# Altium schematic sheet TWindow.schDoc: LiveDesign Evaluation - Video Windows
size A3; Organization: Altium Limited; Address1: L3, 12a Rodborough Rd; Address2: Frenchs Forest; Address3: NSW; Address4: Australia 2086; DocumentNumber: 17; SheetNumber: 17; SheetTotal: 20
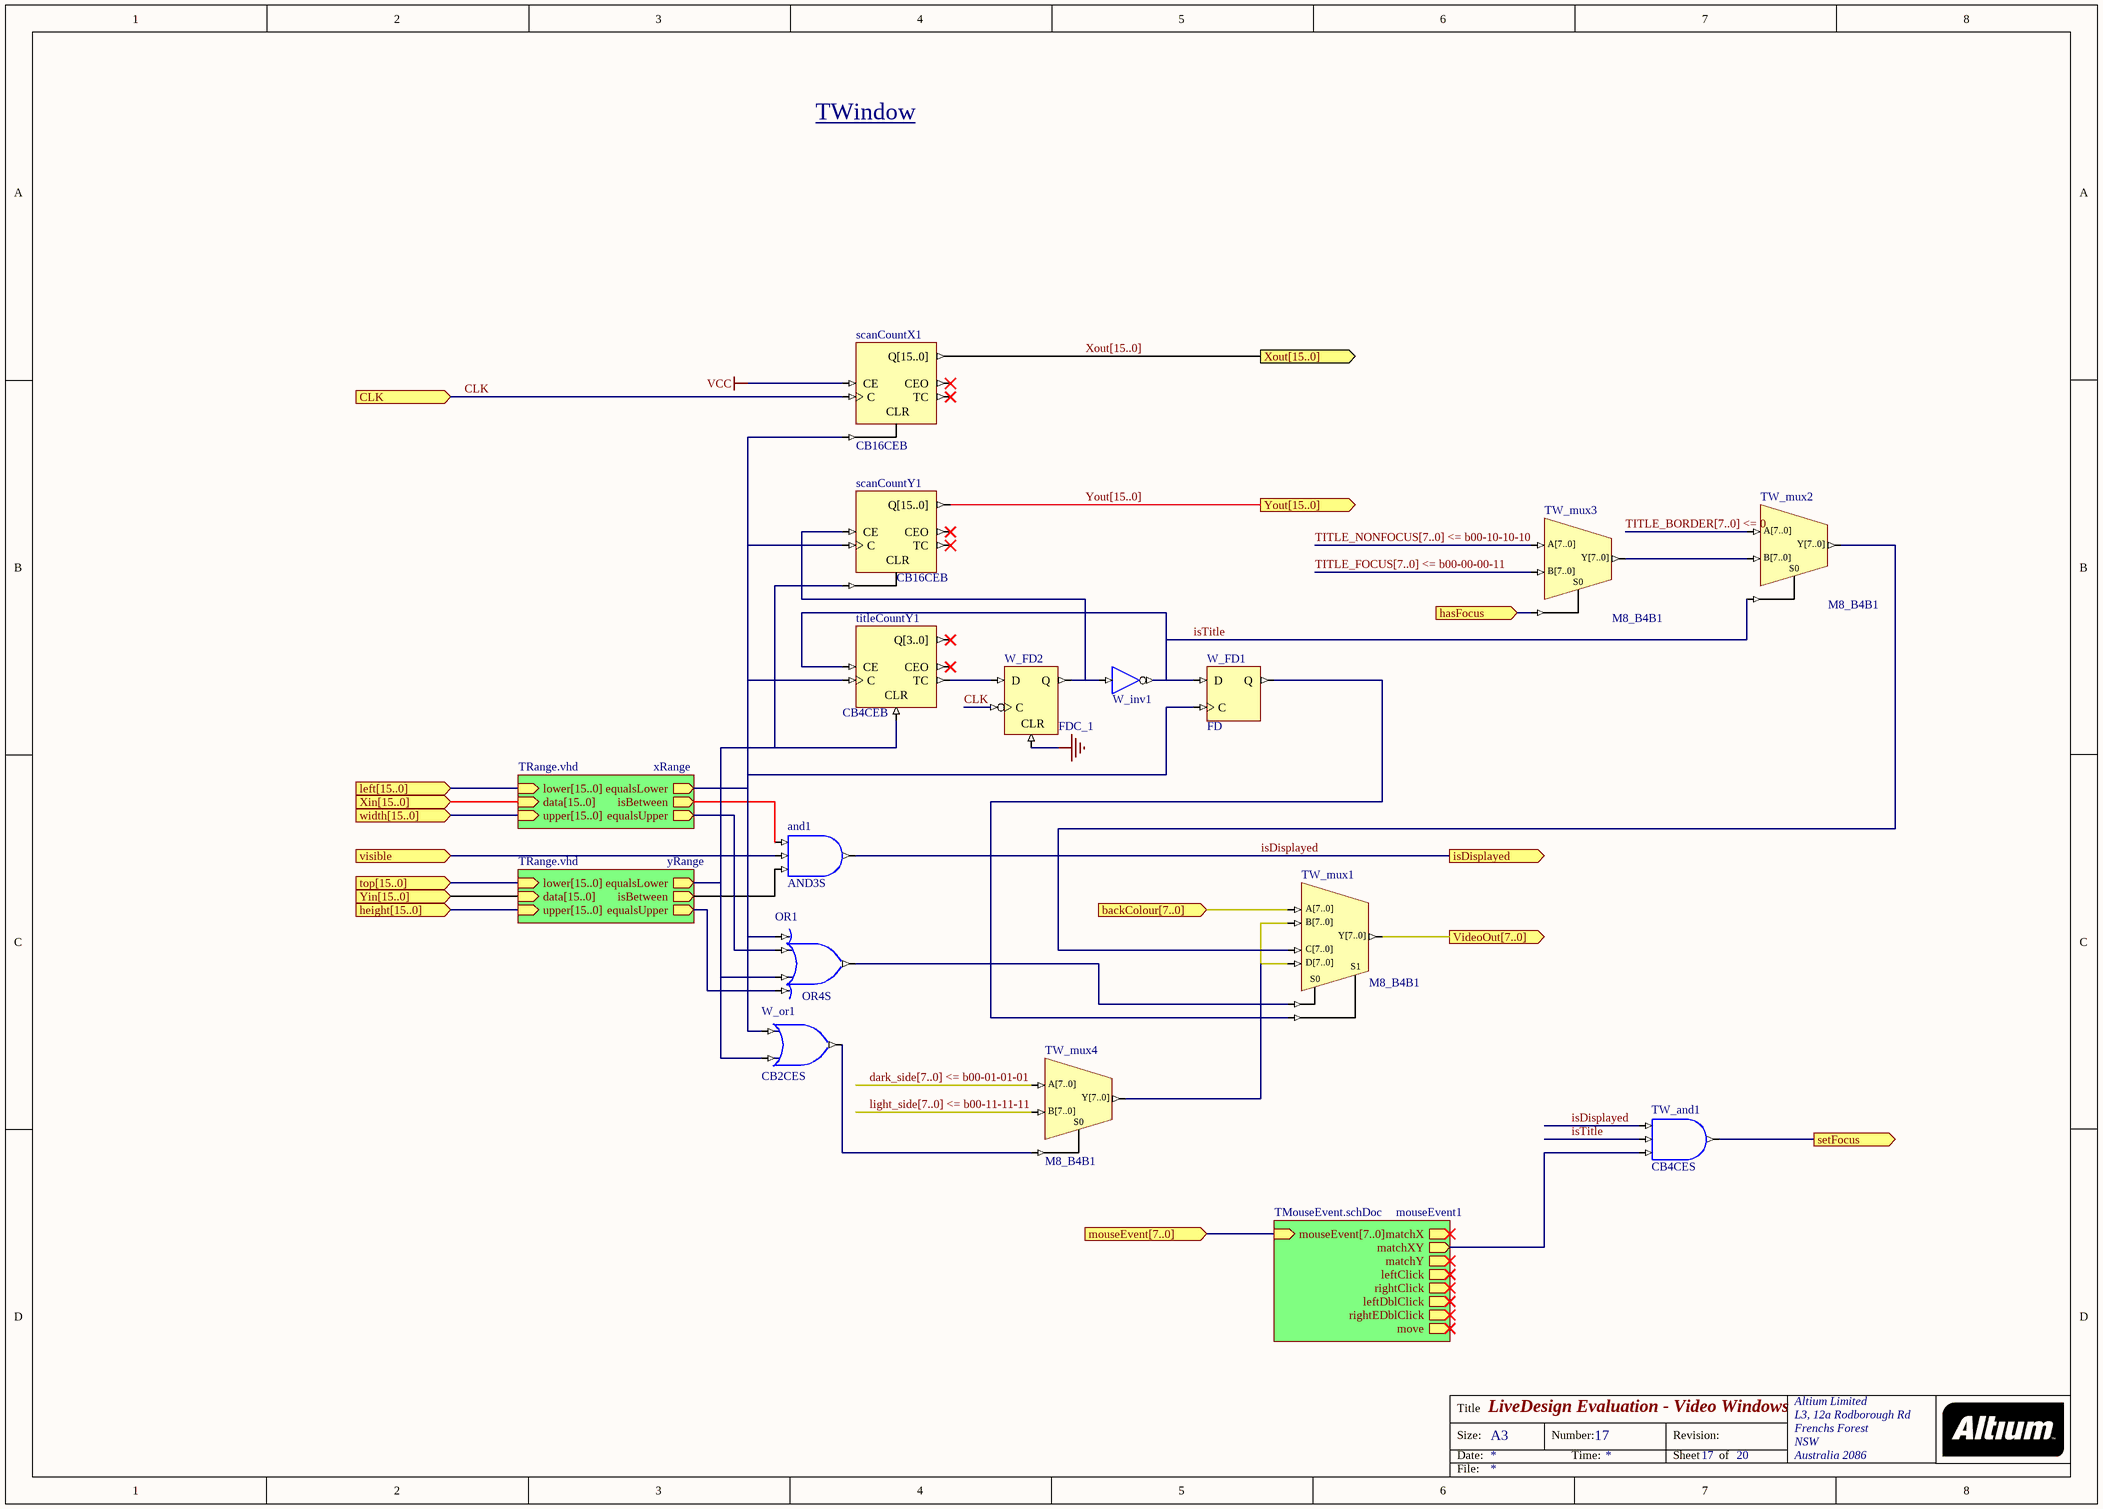
[diagram p0: TWindow.schDoc]

## Parts
and1  AND3S
OR1  OR4S
scanCountX1  CB16CEB
scanCountY1  CB16CEB
titleCountY1  CB4CEB
TW_and1  CB4CES
TW_mux1  M8_B4B1
TW_mux2  M8_B4B1
TW_mux3  M8_B4B1
TW_mux4  M8_B4B1
W_FD1  FD
W_FD2  FDC_1
W_inv1  INV  (value not drawn)
W_or1  CB2CES

## Sub-sheets
mouseEvent1 = TMouseEvent.schDoc: mouseEvent[7..0] (in), matchX (out), matchXY (out), matchY (out), leftClick (out), rightClick (out), leftDblClick (out), rightEDblClick (out), move (out)
xRange = TRange.vhd: lower[15..0] (in), data[15..0] (in), upper[15..0] (in), isBetween (out), equalsLower (out), equalsUpper (out)
yRange = TRange.vhd: lower[15..0] (in), data[15..0] (in), upper[15..0] (in), isBetween (out), equalsLower (out), equalsUpper (out)

## Ports
backColour[7..0] (in), CLK (in), hasFocus (in), height[15..0] (in), isDisplayed (out), left[15..0] (in), mouseEvent[7..0] (in), setFocus (out), top[15..0] (in), VideoOut[7..0] (out), visible (in), width[15..0] (in), Xin[15..0] (in), Xout[15..0] (out), Yin[15..0] (in), Yout[15..0] (out)

## Nets
GND: W_FD2.CLR
VCC: scanCountX1.CE
backColour[7..0]: TW_mux1.A[7..0] ; port backColour[7..0]
CLK: scanCountX1.C W_FD2.C ; port CLK
dark_side[7..0] <= b00-01-01-01: TW_mux4.A[7..0]
hasFocus: TW_mux3.S0 ; port hasFocus
isDisplayed: and1.O TW_and1.I0 ; port isDisplayed
isTitle: titleCountY1.CE TW_and1.I1 TW_mux2.S0 W_FD1.D W_inv1.O
light_side[7..0] <= b00-11-11-11: TW_mux4.B[7..0]
setFocus: TW_and1.O ; port setFocus
TITLE_BORDER[7..0] <= 0: TW_mux2.A[7..0]
TITLE_FOCUS[7..0] <= b00-00-00-11: TW_mux3.B[7..0]
TITLE_NONFOCUS[7..0] <= b00-10-10-10: TW_mux3.A[7..0]
VideoOut[7..0]: TW_mux1.Y[7..0] ; port VideoOut[7..0]
visible: and1.I1 ; port visible
Xout[15..0]: scanCountX1.Q[15..0] ; port Xout[15..0]
Yout[15..0]: scanCountY1.Q[15..0] ; port Yout[15..0]
Netand1_I0: and1.I0 ; sheet xRange/isBetween
Netand1_I2: and1.I2 ; sheet yRange/isBetween
NetOR1_I0: OR1.I0 scanCountX1.CLR scanCountY1.C titleCountY1.C W_FD1.C W_or1.I0 ; sheet xRange/equalsLower
NetOR1_I1: OR1.I1 ; sheet xRange/equalsUpper
NetOR1_I2: OR1.I2 scanCountY1.CLR titleCountY1.CLR W_or1.I1 ; sheet yRange/equalsLower
NetOR1_I3: OR1.I3 ; sheet yRange/equalsUpper
NetOR1_O: OR1.O TW_mux1.S0
NetscanCountY1_CE: scanCountY1.CE W_FD2.Q W_inv1.I
NettitleCountY1_TC: titleCountY1.TC W_FD2.D
NetTW_and1_I2: TW_and1.I2 ; sheet mouseEvent1/matchXY
NetTW_mux1_B[7..0]: TW_mux1.B[7..0] TW_mux1.D[7..0] TW_mux4.Y[7..0]
NetTW_mux1_C[7..0]: TW_mux1.C[7..0] TW_mux2.Y[7..0]
NetTW_mux1_S1: TW_mux1.S1 W_FD1.Q
NetTW_mux2_B[7..0]: TW_mux2.B[7..0] TW_mux3.Y[7..0]
NetTW_mux4_S0: TW_mux4.S0 W_or1.O

Not connected (* = marked no-connect by the designer): scanCountX1 CEO* TC*; scanCountY1 CEO* TC*; titleCountY1 CEO* Q[3..0]*

## Buses and harness runs
bus dark_side[7..0] <= b00-01-01-01
bus light_side[7..0] <= b00-11-11-11
bus port height[15..0] = sheet yRange/upper[15..0]
bus port left[15..0] = sheet xRange/lower[15..0]
bus port mouseEvent[7..0] = sheet mouseEvent1/mouseEvent[7..0]
bus port top[15..0] = sheet yRange/lower[15..0]
bus port width[15..0] = sheet xRange/upper[15..0]
bus port Xin[15..0] = sheet xRange/data[15..0]
bus port Yin[15..0] = sheet yRange/data[15..0]
bus TITLE_BORDER[7..0] <= 0
bus TITLE_FOCUS[7..0] <= b00-00-00-11
bus TITLE_NONFOCUS[7..0] <= b00-10-10-10
bus Xout[15..0] = port Xout[15..0]
bus Yout[15..0] = port Yout[15..0]

## Notes on the sheet
- TWindow
- Title
- Size:
- Date:
- A3
- Number:
- Time:
- Revision:
- Sheet
- of
- File:

## Library data of the parts
and1 TW_and1 = AND3S: 3-Input AND Gate, Single Pin Version; Xilinx Equivalent: AND3; ArchiveName: GENERIC; Published: 9-30-2003; Publisher: Altium Limited; Core Revision: 1.00.00
OR1 = OR4S: 4-Input OR Gate, Single Pin Version; ArchiveName: GENERIC; XilinxEquivalent: OR4; FunctionalClass: Logic Primitive; PortSize: 4; VHDLIB_SIM: GENERIC_LIB; Published: 29-Jan-2004; Publisher: Altium Limited; LastRevisionNo: 1.00.00; HelpURL: CR0118 FPGA Generic Library Guide.pdf#page=410; ComponentLink1URL: CR0136 FPGA Logic Primitive Resource Usage.pdf#page=212; ComponentLink1Description: Core &Resource Usage; SubClass: OR; PortStyle: Single Pin Version
scanCountX1 scanCountY1 = CB16CEB: 16-Bit Cascadable Binary Counters with Clock Enable and Asynchronous Clear, Bus Version; Xilinx Equivalent: CB16CE; ArchiveName: GENERIC; Published: 9-30-2003; Publisher: Altium Limited; Core Revision: 1.00.00
titleCountY1 = CB4CEB: 4-Bit Cascadable Binary Counters with Clock Enable and Asynchronous Clear, Bus Version; ArchiveName: GENERIC; Published: 18-Dec-2003; Publisher: Altium Limited; Core Revision: 1.00.00
TW_mux1 = M8_B4B1: 4x8-Bit Bus to 1x8-Bit Bus Multiplexer; ArchiveName: GENERIC; Published: 9-30-2003; Publisher: Altium Limited; Core Revision: 1.00.00
TW_mux2-TW_mux4 = M8_B2B1: 2x8-Bit Bus to 1x8-Bit Bus Multiplexer; ArchiveName: GENERIC; Published: 9-30-2003; Publisher: Altium Limited; Core Revision: 1.00.00
W_FD1 = FD: D-Type Flip-Flop; ArchiveName: GENERIC; Published: 9-30-2003; Publisher: Altium Limited; Xilinx Equivalent: FD; Core Revision: 1.00.00
W_FD2 = FDC_1: D-Type Negative Edge Flip-Flop with Asynchronous Clear; ArchiveName: GENERIC; Published: 18-Dec-2003; Publisher: Altium Limited; Xilinx Equivalent: FDC_1; Core Revision: 1.00.00
W_inv1 = INV: Inverter; ArchiveName: GENERIC; Published: 18-Dec-2003; Publisher: Altium Limited; Xilinx Equivalent: INV; Core Revision: 1.00.00
W_or1 = OR2S: 2-Input OR Gate, Single Pin Version; Xilinx Equivalent: OR2; ArchiveName: GENERIC; Published: 9-30-2003; Publisher: Altium Limited; Core Revision: 1.00.00